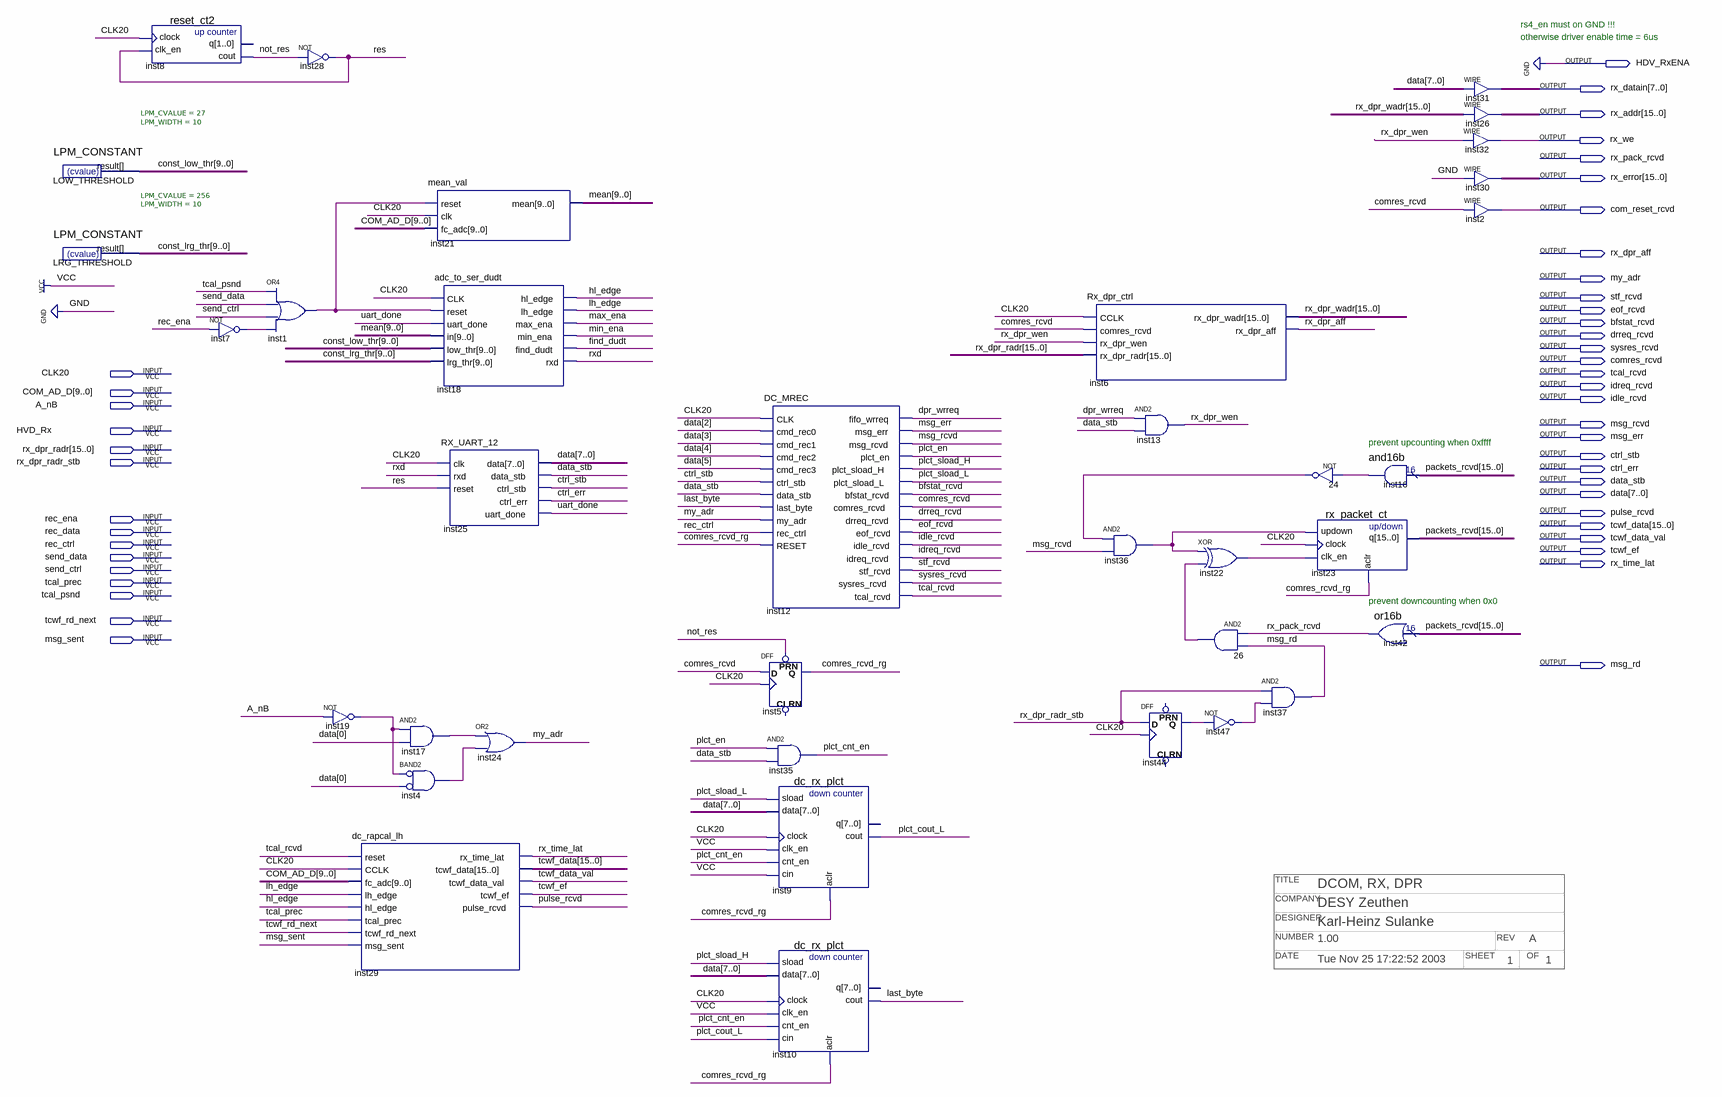
[diagram p0: schematic sheet]
// Quartus schematic DC_Rx_chan_dpr.bdf as structural Verilog: 36 symbols, 45 pins
// Title block: TITLE: DCOM, RX, DPR; COMPANY: DESY Zeuthen; DESIGNER: Karl-Heinz Sulanke; NUMBER: 1.00; REV: A; DATE: Tue Nov 25 17:22:52 2003; SHEET: 1; OF: 1
module DC_Rx_chan_dpr (
  input  CLK20,
  input  [9:0] COM_AD_D,
  input  A_nB,
  input  HVD_Rx,
  input  [15:0] rx_dpr_radr,
  input  rx_dpr_radr_stb,
  input  rec_ena,
  input  rec_data,
  input  rec_ctrl,
  input  send_data,
  input  send_ctrl,
  input  tcal_prec,
  input  tcal_psnd,
  input  tcwf_rd_next,
  input  msg_sent,
  output HDV_RxENA,
  output [7:0] rx_datain,
  output [15:0] rx_addr,
  output rx_we,
  output rx_pack_rcvd,
  output [15:0] rx_error,
  output com_reset_rcvd,
  output rx_dpr_aff,
  output my_adr,
  output stf_rcvd,
  output eof_rcvd,
  output bfstat_rcvd,
  output drreq_rcvd,
  output sysres_rcvd,
  output comres_rcvd,
  output tcal_rcvd,
  output idreq_rcvd,
  output idle_rcvd,
  output msg_rcvd,
  output msg_err,
  output ctrl_stb,
  output ctrl_err,
  output data_stb,
  output [7:0] data,
  output pulse_rcvd,
  output [15:0] tcwf_data,
  output tcwf_data_val,
  output tcwf_ef,
  output rx_time_lat,
  output msg_rd
);

  wire comres_rcvd_rg, dpr_wrreq, find_dudt, hl_edge, inst1_out, inst4_out, inst7_out, inst16_result,
       inst17_out, inst19_out, inst22_out, inst36_out, inst44_q, inst47_out, last_byte, lh_edge, max_ena,
       min_ena, n24_out, n26_out, not_res, plct_cnt_en, plct_cout_L, plct_en, plct_sload_H, plct_sload_L,
       res, rx_dpr_wen, rxd, uart_done;
  wire [9:0] const_low_thr, const_lrg_thr, mean;
  wire [15:0] packets_rcvd, rx_dpr_wadr;

  LPM_CONSTANT #(.LPM_CVALUE(27), .LPM_WIDTH(10)) LOW_THRESHOLD (.result(const_low_thr));
  LPM_CONSTANT #(.LPM_CVALUE(256), .LPM_WIDTH(10)) LRG_THRESHOLD (.result(const_lrg_thr));
  reset_ct2 inst8 (.clock(CLK20), .clk_en(res), .cout(not_res));  // open: q
  not inst7 (inst7_out, rec_ena);
  or inst1 (inst1_out, tcal_psnd, send_data, send_ctrl, inst7_out);
  not inst28 (res, not_res);
  not inst19 (inst19_out, A_nB);
  dc_rapcal_lh inst29 (
    .reset(tcal_rcvd), .CCLK(CLK20), .fc_adc(COM_AD_D), .lh_edge(lh_edge), .hl_edge(hl_edge),
    .tcal_prec(tcal_prec), .tcwf_rd_next(tcwf_rd_next), .msg_sent(msg_sent), .rx_time_lat(rx_time_lat),
    .tcwf_data(tcwf_data), .tcwf_data_val(tcwf_data_val), .tcwf_ef(tcwf_ef), .pulse_rcvd(pulse_rcvd));
  mean_val inst21 (.reset(inst1_out), .clk(CLK20), .fc_adc(COM_AD_D), .mean(mean));
  adc_to_ser_dudt inst18 (
    .CLK(CLK20), .reset(inst1_out), .uart_done(uart_done), .in(mean), .low_thr(const_low_thr),
    .lrg_thr(const_lrg_thr), .hl_edge(hl_edge), .lh_edge(lh_edge), .max_ena(max_ena), .min_ena(min_ena),
    .find_dudt(find_dudt), .rxd(rxd));
  and inst17 (inst17_out, inst19_out, data[0]);
  and inst4 (inst4_out, ~inst19_out, ~data[0]);  // BAND2
  RX_UART_12 inst25 (
    .clk(CLK20), .rxd(rxd), .reset(res), .data(data), .data_stb(data_stb), .ctrl_stb(ctrl_stb),
    .ctrl_err(ctrl_err), .uart_done(uart_done));
  or inst24 (my_adr, inst17_out, inst4_out);
  DC_MREC inst12 (
    .CLK(CLK20), .cmd_rec0(data[2]), .cmd_rec1(data[3]), .cmd_rec2(data[4]), .cmd_rec3(data[5]),
    .ctrl_stb(ctrl_stb), .data_stb(data_stb), .last_byte(last_byte), .my_adr(my_adr), .rec_ctrl(rec_ctrl),
    .RESET(comres_rcvd_rg), .fifo_wrreq(dpr_wrreq), .msg_err(msg_err), .msg_rcvd(msg_rcvd),
    .plct_en(plct_en), .plct_sload_H(plct_sload_H), .plct_sload_L(plct_sload_L), .bfstat_rcvd(bfstat_rcvd),
    .comres_rcvd(comres_rcvd), .drreq_rcvd(drreq_rcvd), .eof_rcvd(eof_rcvd), .idle_rcvd(idle_rcvd),
    .idreq_rcvd(idreq_rcvd), .stf_rcvd(stf_rcvd), .sysres_rcvd(sysres_rcvd), .tcal_rcvd(tcal_rcvd));
  DFF inst5 (.CLK(CLK20), .D(comres_rcvd), .PRN(not_res), .Q(comres_rcvd_rg));  // open: CLRN
  and inst35 (plct_cnt_en, plct_en, data_stb);
  dc_rx_plct inst9 (
    .sload(plct_sload_L), .data(data), .clock(CLK20), .clk_en(1'b1), .cnt_en(plct_cnt_en), .cin(1'b1),
    .aclr(comres_rcvd_rg), .cout(plct_cout_L));  // open: q
  dc_rx_plct inst10 (
    .sload(plct_sload_H), .data(data), .clock(CLK20), .clk_en(1'b1), .cnt_en(plct_cnt_en), .cin(plct_cout_L),
    .aclr(comres_rcvd_rg), .cout(last_byte));  // open: q
  Rx_dpr_ctrl inst6 (
    .CCLK(CLK20), .comres_rcvd(comres_rcvd), .rx_dpr_wen(rx_dpr_wen), .rx_dpr_radr(rx_dpr_radr),
    .rx_dpr_wadr(rx_dpr_wadr), .rx_dpr_aff(rx_dpr_aff));
  and inst13 (rx_dpr_wen, dpr_wrreq, data_stb);
  and inst36 (inst36_out, n24_out, msg_rcvd);
  DFF inst44 (.CLK(CLK20), .D(rx_dpr_radr_stb), .Q(inst44_q));  // open: CLRN, PRN
  xor inst22 (inst22_out, inst36_out, n26_out);
  and u_26 (n26_out, rx_pack_rcvd, msg_rd);
  not inst47 (inst47_out, inst44_q);
  and inst37 (msg_rd, rx_dpr_radr_stb, inst47_out);
  not u_24 (n24_out, inst16_result);
  rx_packet_ct inst23 (
    .updown(inst36_out), .clock(CLK20), .clk_en(inst22_out), .aclr(comres_rcvd_rg), .q(packets_rcvd));
  and16b inst16 (.data(packets_rcvd), .result(inst16_result));
  or16b inst42 (.data(packets_rcvd), .result(rx_pack_rcvd));
  assign rx_datain = data;  // WIRE inst31
  assign rx_addr = rx_dpr_wadr;  // WIRE inst26
  assign rx_we = rx_dpr_wen;  // WIRE inst32
  assign rx_error = {16{1'b0}};  // WIRE inst30
  assign com_reset_rcvd = comres_rcvd;  // WIRE inst2

  assign HDV_RxENA = 1'b0;

  // Notes on the sheet:
  //   rs4_en must on GND !!!
  //   otherwise driver enable time = 6us
  //   prevent upcounting when 0xffff
  //   prevent downcounting when 0x0
endmodule
